# EAGLE design FeatherAdapter (EAGLE 9.6.2)
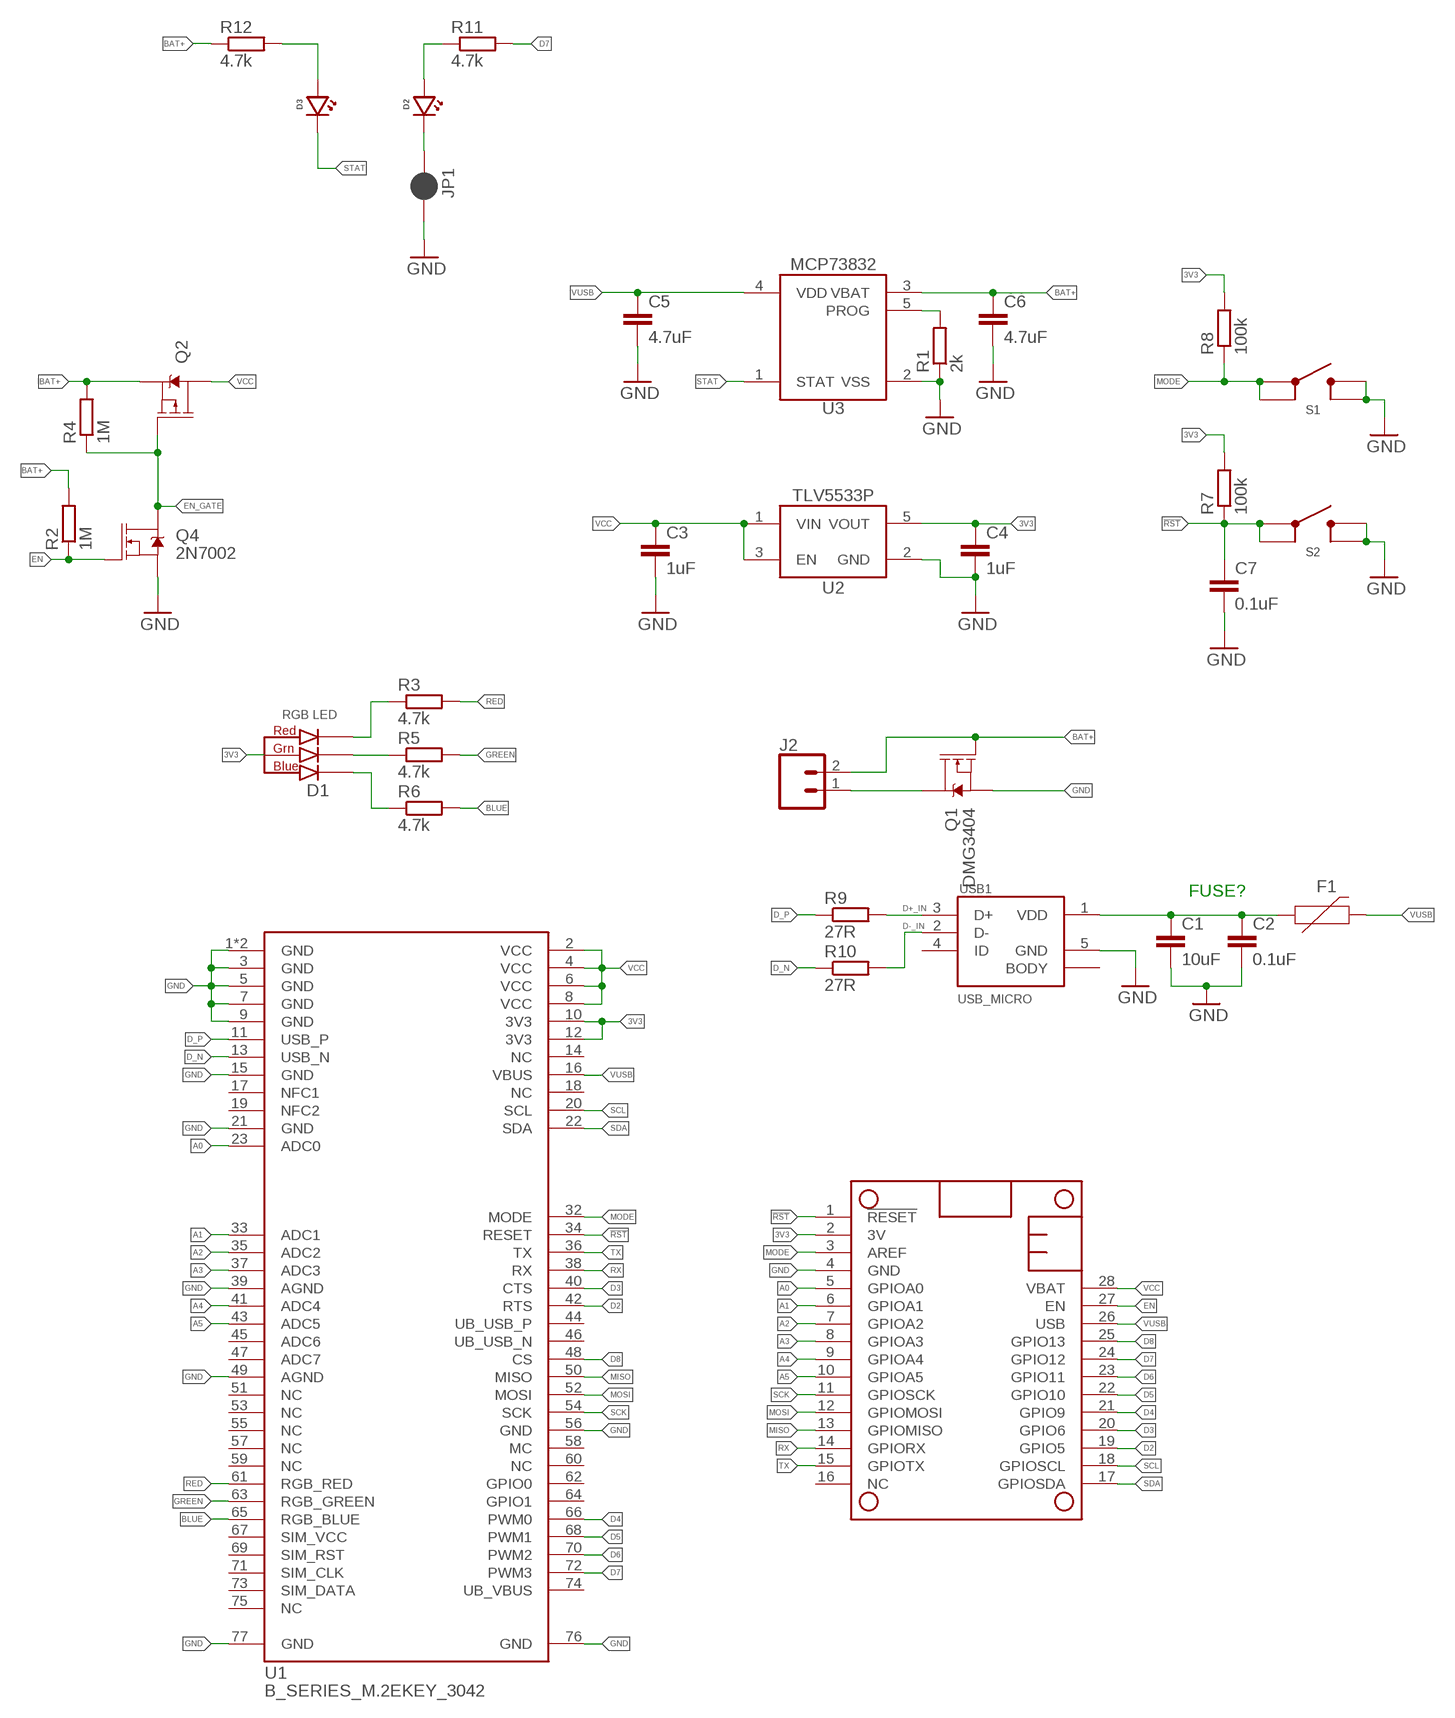
[diagram p0: schematic, sheet 1]

## Parts
C1  10uF  C-EU10UFC0805  [C0805]
C2  0.1uF  C-EU0.1UFC0402  [C0402]
C3  1uF  C-EU1UFC0603  [C0603]
C4  1uF  C-EU1UFC0603  [C0603]
C5  4.7uF  C-EU4.7UFC0805  [C0805]
C6  4.7uF  C-EU4.7UFC0805  [C0805]
C7  0.1uF  C-EU0.1UFC0402  [C0402]
D1  CLVBA-FKA  [CLVBA-FKA]
D2  LEDBLUE0603  [LED_0603]
D3  LEDAMBER0603  [LED_0603]
F1  PPTC1.5A  [1206]
J2  CONN_02-JST-2MM-SMT  [JST-2-SMD]
JP1  JUMPER-SMT_2_NC_PASTE_SILK_ROUND  [SMT-JUMPER_2_NC_SILK_ROUND]
MS1  FEATHERWING_SMD_LAYOUT  [FEATHER_SMD_MIN]
Q1  DMG3404  MOSFET-NCH-DMG3404L  [SOT23-3]
Q2  NX2301P  MOSFET-PCH-NX2301P  [SOT23-3]
Q4  2N7002  MOSFET-NCH-2N7002P  [SOT23-3]
R1  2k  R-EU_2KR0402  [R0402]
R2  1M  R-EU_1MR0402  [R0402]
R3  4.7k  R-EU_4.7KR0402  [R0402]
R4  1M  R-EU_1MR0402  [R0402]
R5  4.7k  R-EU_4.7KR0402  [R0402]
R6  4.7k  R-EU_4.7KR0402  [R0402]
R7  100k  R-EU_100KR0402  [R0402]
R8  100k  R-EU_100KR0402  [R0402]
R9  27R  R-EU_27R0402  [R0402]
R10  27R  R-EU_27R0402  [R0402]
R11  4.7k  R-EU_4.7KR0402  [R0402]
R12  4.7k  R-EU_4.7KR0402  [R0402]
S1  BUTTON4.5X4.5  [SWITCH_4.5MM]
S2  BUTTON4.5X4.5  [SWITCH_4.5MM]
U1  B_SERIES_M.2EKEY_3042  [PARTICLE_M.2EKEY]
U2  TLV755P3V3SOT23  [DBV0005A]
U3  MCP73832SOT  [SOT23-5]
USB1  USB_MICRO  [10118194-0001LF_10118194-0001LF_LONGER_PADS]

## Nets
3V3: C4.1 D1.2(ANODE) MS1.2(3V) R7.2 R8.2 U1.10(3V3) U1.12(3V3) U2.5(VOUT)
!RST: C7.1 MS1.1(!RESET) R7.1 S2.1 S2.2 U1.34(RESET)
A0: MS1.5(GPIOA0) U1.23(ADC0)
A1: MS1.6(GPIOA1) U1.33(ADC1)
A2: MS1.7(GPIOA2) U1.35(ADC2)
A3: MS1.8(GPIOA3) U1.37(ADC3)
A4: MS1.9(GPIOA4) U1.41(ADC4)
A5: MS1.10(GPIOA5) U1.43(ADC5)
BAT+: C6.1 J2.2 Q1.1(G) Q2.2(S) R2.2 R4.2 R12.1 U3.3(VBAT)
BAT-: J2.1 Q1.3(D)
BLUE: R6.2 U1.65(RGB_BLUE)
D2: MS1.19(GPIO5) U1.42(RTS)
D3: MS1.20(GPIO6) U1.40(CTS)
D4: MS1.21(GPIO9) U1.66(PWM0)
D5: MS1.22(GPIO10) U1.68(PWM1)
D6: MS1.23(GPIO11) U1.70(PWM2)
D7: MS1.24(GPIO12) R11.2 U1.72(PWM3)
D8: MS1.25(GPIO13) U1.48(CS)
D+_IN: R9.2 USB1.3(D+)
D-_IN: R10.2 USB1.2(D-)
D_N [diff pairs]: R10.1 U1.13(USB_N)
D_P [diff pairs]: R9.1 U1.11(USB_P)
EN: MS1.27(EN) Q4.1(G) R2.1
EN_GATE: Q2.1(G) Q4.3(D) R4.1
GND: C1.2 C2.2 C3.2 C4.2 C5.2 C6.2 C7.2 JP1.2 MS1.4(GND) Q1.2(S) Q4.2(S) R1.1 S1.3 S1.4 S2.3 S2.4 U1.1(GND) U1.3(GND) U1.5(GND) U1.7(GND) U1.9(GND) U1.15(GND) U1.21(GND) U1.39(AGND) U1.49(AGND) U1.56(GND) U1.76(GND) U1.77(GND) U1.GND U2.2(GND) U3.2(VSS) USB1.5(GND)
GREEN: R5.2 U1.63(RGB_GREEN)
MISO: MS1.13(GPIOMISO) U1.50(MISO)
MODE: MS1.3(AREF) R8.1 S1.1 S1.2 U1.32(MODE)
MOSI: MS1.12(GPIOMOSI) U1.52(MOSI)
N$2: R1.2 U3.5(PROG)
N$3: C1.1 C2.1 F1.1 USB1.1(VDD)
N$4: D2.CATHODE JP1.1
N$5: D1.1(RED_CATH) R3.1
N$6: D1.4(GREEN_CATH) R5.1
N$7: D1.3(BLUE_CATH) R6.1
N$8: D2.ANODE R11.1
N$10: D3.ANODE R12.2
RED: R3.2 U1.61(RGB_RED)
RX: MS1.14(GPIORX) U1.38(RX)
SCK: MS1.11(GPIOSCK) U1.54(SCK)
SCL: MS1.18(GPIOSCL) U1.20(SCL)
SDA: MS1.17(GPIOSDA) U1.22(SDA)
STAT: D3.CATHODE U3.1(STAT)
TX: MS1.15(GPIOTX) U1.36(TX)
VCC: C3.1 MS1.28(VBAT) Q2.3(D) U1.2(VCC) U1.4(VCC) U1.6(VCC) U1.8(VCC) U2.1(VIN) U2.3(EN)
VUSB: C5.1 F1.2 MS1.26(USB) U1.16(VBUS) U3.4(VDD)
Unconnected: MS1.16(NC) U1.14(NC) U1.17(NFC1) U1.18(NC) U1.19(NFC2) U1.44(UB_USB_P) U1.45(ADC6) U1.46(UB_USB_N) U1.47(ADC7) U1.51(NC) U1.53(NC) U1.55(NC) U1.57(NC) U1.58(MC) U1.59(NC) U1.60(NC) U1.62(GPIO0) U1.64(GPIO1) U1.69(SIM_RST) U1.71(SIM_CLK) U1.73(SIM_DATA) U1.75(NC) U1.!RESET U1.SWCLK U1.SWDIO U1.SWO USB1.4(ID) USB1.BODY@1(BODY) USB1.BODY@2(BODY) USB1.BODY@3(BODY) USB1.BODY@4(BODY) USB1.BODY@7(BODY) USB1.BODY@8(BODY)

## Notes on the sheet
- FUSE?

## Power pins joined to a net without a drawn wire
SIM_VCC: U1.67(SIM_VCC)
UB_VBUS: U1.74(UB_VBUS)

## Library data of the parts
C1 = bschulz_passives:C-EU: CAPACITOR, European symbol; DIGIKEY: 490-6473-1-ND; MF: Murata; MPN: GRM21BR61C106KE15K
C2 C7 = bschulz_passives:C-EU: CAPACITOR, European symbol; DIGIKEY: 490-4759-1-ND; MF: Murata; MPN: GCM155R71C104KA55D
C3 C4 = bschulz_passives:C-EU: CAPACITOR, European symbol; DIGIKEY: 587-2984-1-ND; MF: Yaiyo Yuden; MPN: TMK107B7105KA-T
C5 C6 = bschulz_passives:C-EU: CAPACITOR, European symbol; DIGIKEY: 399-7415-1-ND; MF: Kemet; MPN: C0805C475K4RACTU
D1 = bschulz:CLVBA-FKA: Cree RGB LED, Small Package, Common Anode, CLVBA-FKA Digikey: https://www.digikey.com/product-detail/en/cree-inc/CLVBA-FKA-CAEDH8BBB7A363/CLVBA-FKA-CAEDH8BBB7A363CT-ND/2650500; DIGIKEY: CLVBA-FKA-CAEDH8BBB7A363CT-ND; MF: Cree; MPN: CLVBA-FKA-CAEDH8BBB7A363
D2 = bschulz:LED: Genaric LED; DIGIKEY: 732-4966-1-ND; MF: Wurth; MPN: 150060BS75000
D3 = bschulz:LED: Genaric LED; DIGIKEY: 732-150060AS75000CT-ND; MF: Wurth; MPN: 150060AS75000
F1 = bschulz:PPTC: Bel Fuse PPTC; DIGIKEY: MF-NSMF150-2CT-ND; MF: Bourns; MPN: MF-NSMF150-2
J2 = bschulz:CONN_02: Genaric 2 terminal header SCREW_2.54 <https://www.digikey.com/product-detail/en/on-shore-technology-inc/OSTVN02A150/ED10561-ND/1588862> 39532_RA <https://www.digikey.com/product-detail/en/molex/0395321002/WM7845-ND/1280696>; DIGIKEY: 455-1749-1-ND; MF: JST; MPN: S2B-PH-SM4-TB(LF)(SN); PROD_ID: CONN-11443
JP1 = bschulz:JUMPER-SMT_2_NC_PASTE: Normally closed solder jumper This jumper has an aperture in the stencil to allow solder paste to bridge the split in the wire so it's normally closed (NC). Wick off the solder to open the connection. Reapply solder to reclose the connection.; DIGIKEY: DNP; MF: N/A; MPN: N/A
MS1 = bschulz:FEATHERWING
Q1 = bschulz:MOSFET-NCH: N-channel MOSFET Small Signal/Low Power: BSS138 2N7002P 2N7002PW RE1C002UN; DIGIKEY: DMG3404L-7DICT-ND; MF: Diodes Incorporated; MPN: DMG3404L-7
Q2 = bschulz:MOSFET-PCH: P-channel MOSFET Small Signal/Low Power:; DIGIKEY: 1727-1148-1-ND; MF: Nexperia; MPN: NX2301P,215
Q4 = bschulz:MOSFET-NCH: N-channel MOSFET Small Signal/Low Power: BSS138 2N7002P 2N7002PW RE1C002UN; DIGIKEY: 1727-4692-1-ND; MF: Nexperia; MPN: 2N7002P,215
R1 = bschulz_passives:R-EU_: RESISTOR, European symbol Digikey Parts: Yageo, 0402 <https://www.digikey.com/products/en/resistors/chip-resistor-surface-mount/52?k=&pkeyword=&sv=0&s=4356&sf=1&FV=-1%7C13%2C7%7C2%2C1291%7C39157%2C1989%7C0%2C-8%7C52%2C3%7C1131%2C3%7C2503&quantity=&ColumnSort=0&page=1&stock=1&pageSize=25> Yageo, 0603 <https://www.digikey.com/products/en/resistors/chip-resistor-surface-mount/52?k=&pkeyword=&sv=0&pv1291=39245&sf=1&FV=-5%7C4356%2C-5%7C47360%2C-8%7C52%2C-1%7C13%2C7%7C2%2C1989%7C0&quantity=10&ColumnSort=1000011&page=1&stock=1&pageSize=25> Panasonic, 0603 <https://www.digikey.com/products/en/resistors/chip-resistor-surface-mount/52?k=&pkeyword=&pv252=68&sf=0&FV=ffec373d%2C1c0002%2C142c040c%2C1f140000%2Cffe00034%2C80002%2Cc0001&quantity=&ColumnSort=0&page=1&stock=1&pageSize=25> Panasonic, precision, 0603 <https://www.digikey.com/products/en/resistors/chip-resistor-surface-mount/52?FV=ffec4907%2Cfffc000a%2Cc0172%2C142c040c%2C1f140000%2Cffe00034%2C1c0002&quantity=100&ColumnSort=2085&page=1&stock=1&pageSize=25> Panasonic, 0805 <https://www.digikey.com/products/en/resistors/chip-resistor-surface-mount/52?k=&pkeyword=&pv3=1&sf=0&FV=ffec373d%2C1c0002%2C1f140000%2Cffe00034%2C142c040d&quantity=&ColumnSort=0&page=1&stock=1&pageSize=25> Rohm, current sense <https://www.digikey.com/products/en/resistors/chip-resistor-surface-mount/52?k=&pkeyword=&pv3=1&sf=0&FV=ffecb688%2C1f140000%2Cffe00034%2C1c0002&quantity=&ColumnSort=0&page=1&stock=1&pageSize=25> Vishay, pulse proof automotive <https://www.digikey.com/products/en/resistors/chip-resistor-surface-mount/52?k=&pkeyword=&pv7=2&sf=0&FV=ffec5d6b%2Cffe00034%2C1f140000&quantity=&ColumnSort=0&page=1&stock=1&pageSize=25>; DIGIKEY: 311-2KLRCT-ND; MF: Yageo; MPN: RC0402FR-072KL; VALUE_PART: 2k
R2 R4 = bschulz_passives:R-EU_: RESISTOR, European symbol Digikey Parts: Yageo, 0402 <https://www.digikey.com/products/en/resistors/chip-resistor-surface-mount/52?k=&pkeyword=&sv=0&s=4356&sf=1&FV=-1%7C13%2C7%7C2%2C1291%7C39157%2C1989%7C0%2C-8%7C52%2C3%7C1131%2C3%7C2503&quantity=&ColumnSort=0&page=1&stock=1&pageSize=25> Yageo, 0603 <https://www.digikey.com/products/en/resistors/chip-resistor-surface-mount/52?k=&pkeyword=&sv=0&pv1291=39245&sf=1&FV=-5%7C4356%2C-5%7C47360%2C-8%7C52%2C-1%7C13%2C7%7C2%2C1989%7C0&quantity=10&ColumnSort=1000011&page=1&stock=1&pageSize=25> Panasonic, 0603 <https://www.digikey.com/products/en/resistors/chip-resistor-surface-mount/52?k=&pkeyword=&pv252=68&sf=0&FV=ffec373d%2C1c0002%2C142c040c%2C1f140000%2Cffe00034%2C80002%2Cc0001&quantity=&ColumnSort=0&page=1&stock=1&pageSize=25> Panasonic, precision, 0603 <https://www.digikey.com/products/en/resistors/chip-resistor-surface-mount/52?FV=ffec4907%2Cfffc000a%2Cc0172%2C142c040c%2C1f140000%2Cffe00034%2C1c0002&quantity=100&ColumnSort=2085&page=1&stock=1&pageSize=25> Panasonic, 0805 <https://www.digikey.com/products/en/resistors/chip-resistor-surface-mount/52?k=&pkeyword=&pv3=1&sf=0&FV=ffec373d%2C1c0002%2C1f140000%2Cffe00034%2C142c040d&quantity=&ColumnSort=0&page=1&stock=1&pageSize=25> Rohm, current sense <https://www.digikey.com/products/en/resistors/chip-resistor-surface-mount/52?k=&pkeyword=&pv3=1&sf=0&FV=ffecb688%2C1f140000%2Cffe00034%2C1c0002&quantity=&ColumnSort=0&page=1&stock=1&pageSize=25> Vishay, pulse proof automotive <https://www.digikey.com/products/en/resistors/chip-resistor-surface-mount/52?k=&pkeyword=&pv7=2&sf=0&FV=ffec5d6b%2Cffe00034%2C1f140000&quantity=&ColumnSort=0&page=1&stock=1&pageSize=25>; DIGIKEY: 311-1.00MLRCT-ND; MF: Yageo; MPN: RC0402FR-071ML; VALUE_PART: 1M
R3 R5 R6 R11 R12 = bschulz_passives:R-EU_: RESISTOR, European symbol Digikey Parts: Yageo, 0402 <https://www.digikey.com/products/en/resistors/chip-resistor-surface-mount/52?k=&pkeyword=&sv=0&s=4356&sf=1&FV=-1%7C13%2C7%7C2%2C1291%7C39157%2C1989%7C0%2C-8%7C52%2C3%7C1131%2C3%7C2503&quantity=&ColumnSort=0&page=1&stock=1&pageSize=25> Yageo, 0603 <https://www.digikey.com/products/en/resistors/chip-resistor-surface-mount/52?k=&pkeyword=&sv=0&pv1291=39245&sf=1&FV=-5%7C4356%2C-5%7C47360%2C-8%7C52%2C-1%7C13%2C7%7C2%2C1989%7C0&quantity=10&ColumnSort=1000011&page=1&stock=1&pageSize=25> Panasonic, 0603 <https://www.digikey.com/products/en/resistors/chip-resistor-surface-mount/52?k=&pkeyword=&pv252=68&sf=0&FV=ffec373d%2C1c0002%2C142c040c%2C1f140000%2Cffe00034%2C80002%2Cc0001&quantity=&ColumnSort=0&page=1&stock=1&pageSize=25> Panasonic, precision, 0603 <https://www.digikey.com/products/en/resistors/chip-resistor-surface-mount/52?FV=ffec4907%2Cfffc000a%2Cc0172%2C142c040c%2C1f140000%2Cffe00034%2C1c0002&quantity=100&ColumnSort=2085&page=1&stock=1&pageSize=25> Panasonic, 0805 <https://www.digikey.com/products/en/resistors/chip-resistor-surface-mount/52?k=&pkeyword=&pv3=1&sf=0&FV=ffec373d%2C1c0002%2C1f140000%2Cffe00034%2C142c040d&quantity=&ColumnSort=0&page=1&stock=1&pageSize=25> Rohm, current sense <https://www.digikey.com/products/en/resistors/chip-resistor-surface-mount/52?k=&pkeyword=&pv3=1&sf=0&FV=ffecb688%2C1f140000%2Cffe00034%2C1c0002&quantity=&ColumnSort=0&page=1&stock=1&pageSize=25> Vishay, pulse proof automotive <https://www.digikey.com/products/en/resistors/chip-resistor-surface-mount/52?k=&pkeyword=&pv7=2&sf=0&FV=ffec5d6b%2Cffe00034%2C1f140000&quantity=&ColumnSort=0&page=1&stock=1&pageSize=25>; DIGIKEY: 311-4.7KJRCT-ND; MF: Yageo; MPN: RC0402JR-074K7L; VALUE_PART: 4.7k
R7 R8 = bschulz_passives:R-EU_: RESISTOR, European symbol Digikey Parts: Yageo, 0402 <https://www.digikey.com/products/en/resistors/chip-resistor-surface-mount/52?k=&pkeyword=&sv=0&s=4356&sf=1&FV=-1%7C13%2C7%7C2%2C1291%7C39157%2C1989%7C0%2C-8%7C52%2C3%7C1131%2C3%7C2503&quantity=&ColumnSort=0&page=1&stock=1&pageSize=25> Yageo, 0603 <https://www.digikey.com/products/en/resistors/chip-resistor-surface-mount/52?k=&pkeyword=&sv=0&pv1291=39245&sf=1&FV=-5%7C4356%2C-5%7C47360%2C-8%7C52%2C-1%7C13%2C7%7C2%2C1989%7C0&quantity=10&ColumnSort=1000011&page=1&stock=1&pageSize=25> Panasonic, 0603 <https://www.digikey.com/products/en/resistors/chip-resistor-surface-mount/52?k=&pkeyword=&pv252=68&sf=0&FV=ffec373d%2C1c0002%2C142c040c%2C1f140000%2Cffe00034%2C80002%2Cc0001&quantity=&ColumnSort=0&page=1&stock=1&pageSize=25> Panasonic, precision, 0603 <https://www.digikey.com/products/en/resistors/chip-resistor-surface-mount/52?FV=ffec4907%2Cfffc000a%2Cc0172%2C142c040c%2C1f140000%2Cffe00034%2C1c0002&quantity=100&ColumnSort=2085&page=1&stock=1&pageSize=25> Panasonic, 0805 <https://www.digikey.com/products/en/resistors/chip-resistor-surface-mount/52?k=&pkeyword=&pv3=1&sf=0&FV=ffec373d%2C1c0002%2C1f140000%2Cffe00034%2C142c040d&quantity=&ColumnSort=0&page=1&stock=1&pageSize=25> Rohm, current sense <https://www.digikey.com/products/en/resistors/chip-resistor-surface-mount/52?k=&pkeyword=&pv3=1&sf=0&FV=ffecb688%2C1f140000%2Cffe00034%2C1c0002&quantity=&ColumnSort=0&page=1&stock=1&pageSize=25> Vishay, pulse proof automotive <https://www.digikey.com/products/en/resistors/chip-resistor-surface-mount/52?k=&pkeyword=&pv7=2&sf=0&FV=ffec5d6b%2Cffe00034%2C1f140000&quantity=&ColumnSort=0&page=1&stock=1&pageSize=25>; DIGIKEY: 311-100KLRCT-ND; MF: Yageo; MPN: RC0402FR-07100KL; VALUE_PART: 100k
R9 R10 = bschulz_passives:R-EU_: RESISTOR, European symbol Digikey Parts: Yageo, 0402 <https://www.digikey.com/products/en/resistors/chip-resistor-surface-mount/52?k=&pkeyword=&sv=0&s=4356&sf=1&FV=-1%7C13%2C7%7C2%2C1291%7C39157%2C1989%7C0%2C-8%7C52%2C3%7C1131%2C3%7C2503&quantity=&ColumnSort=0&page=1&stock=1&pageSize=25> Yageo, 0603 <https://www.digikey.com/products/en/resistors/chip-resistor-surface-mount/52?k=&pkeyword=&sv=0&pv1291=39245&sf=1&FV=-5%7C4356%2C-5%7C47360%2C-8%7C52%2C-1%7C13%2C7%7C2%2C1989%7C0&quantity=10&ColumnSort=1000011&page=1&stock=1&pageSize=25> Panasonic, 0603 <https://www.digikey.com/products/en/resistors/chip-resistor-surface-mount/52?k=&pkeyword=&pv252=68&sf=0&FV=ffec373d%2C1c0002%2C142c040c%2C1f140000%2Cffe00034%2C80002%2Cc0001&quantity=&ColumnSort=0&page=1&stock=1&pageSize=25> Panasonic, precision, 0603 <https://www.digikey.com/products/en/resistors/chip-resistor-surface-mount/52?FV=ffec4907%2Cfffc000a%2Cc0172%2C142c040c%2C1f140000%2Cffe00034%2C1c0002&quantity=100&ColumnSort=2085&page=1&stock=1&pageSize=25> Panasonic, 0805 <https://www.digikey.com/products/en/resistors/chip-resistor-surface-mount/52?k=&pkeyword=&pv3=1&sf=0&FV=ffec373d%2C1c0002%2C1f140000%2Cffe00034%2C142c040d&quantity=&ColumnSort=0&page=1&stock=1&pageSize=25> Rohm, current sense <https://www.digikey.com/products/en/resistors/chip-resistor-surface-mount/52?k=&pkeyword=&pv3=1&sf=0&FV=ffecb688%2C1f140000%2Cffe00034%2C1c0002&quantity=&ColumnSort=0&page=1&stock=1&pageSize=25> Vishay, pulse proof automotive <https://www.digikey.com/products/en/resistors/chip-resistor-surface-mount/52?k=&pkeyword=&pv7=2&sf=0&FV=ffec5d6b%2Cffe00034%2C1f140000&quantity=&ColumnSort=0&page=1&stock=1&pageSize=25>; DIGIKEY: YAG3086CT-ND; MF: Yageo; MPN: RC0402FR-0727RL; VALUE_PART: 27
S1 S2 = bschulz:BUTTON: Genaric SPST Push button; DIGIKEY: PTS647SN50SMTR2LFSCT-ND; MF: C&K; MPN: PTS 647 SN50 SMTR2 LFS
U1 = Particle-Devices:B_SERIES_M.2EKEY_: Particle B Series SoM 3042 M.2 Connector with E Key Width = 30mm Length = 42mm Height = 4.2mm Key = E
U2 = bschulz:TLV755P: TLV755xx(x)P - Low IQ, Small Size, Low Dropout, Positive Voltage Regulator Characteristics: Vin: 1.45V ~ 5.5V Vout: Many, fixed IQ: 25μA (typ) Output Current: 500 mA Dropout Voltage: 238mV @ 500mA Operating Temperature: -40°C to 85°C Digikey: TLV75533PDBVR (3v3, SOT-23) <https://www.digikey.com/product-detail/en/texas-instruments/TLV75533PDBVR/296-50411-1-ND/9685550>; DIGIKEY: 296-50411-1-ND; DISP: TLV5533P; MF: TI; MPN: TLV75533PDBVR
U3 = bschulz:MCP7383*: MCP7383x - Single-Cell Integrated Li-Ion/LiPo Charge Controller With Status Output Characteristics: Vin: 3.75 ~ 6V IQ: 53μA typ Voltage Accuracy: 1% typ Output Current: 500 mA (max) Operating Temperature: -40°C to 85°C MCP73831: STAT output is tri-state logic MCP73832: STAT output is open drain Digikey: MCP73831T-2ACI/OTCT-ND (MCP73831, SOT) <https://www.digikey.com/product-detail/en/microchip-technology/MCP73831T-2ACI-OT/MCP73831T-2ACI-OTCT-ND/1979802> MCP73832T-2ACI/OTCT-ND (MCP73832, SOT) <https://www.digikey.com/product-detail/en/microchip-technology/MCP73832T-2ACI-OT/MCP73832T-2ACI-OTCT-ND/1979805>; DIGIKEY: MCP73832T-2ACI/OTCT-ND; DISP: MCP73832; MF: Microchip; MPN: MCP73832T-2ACI/OT
USB1 = bschulz:USB_MICRO: General Micro USB - AB Connector; DIGIKEY: 609-4618-1-ND; MF: Amphenol; MPN: 10118194-0001LF

## Board
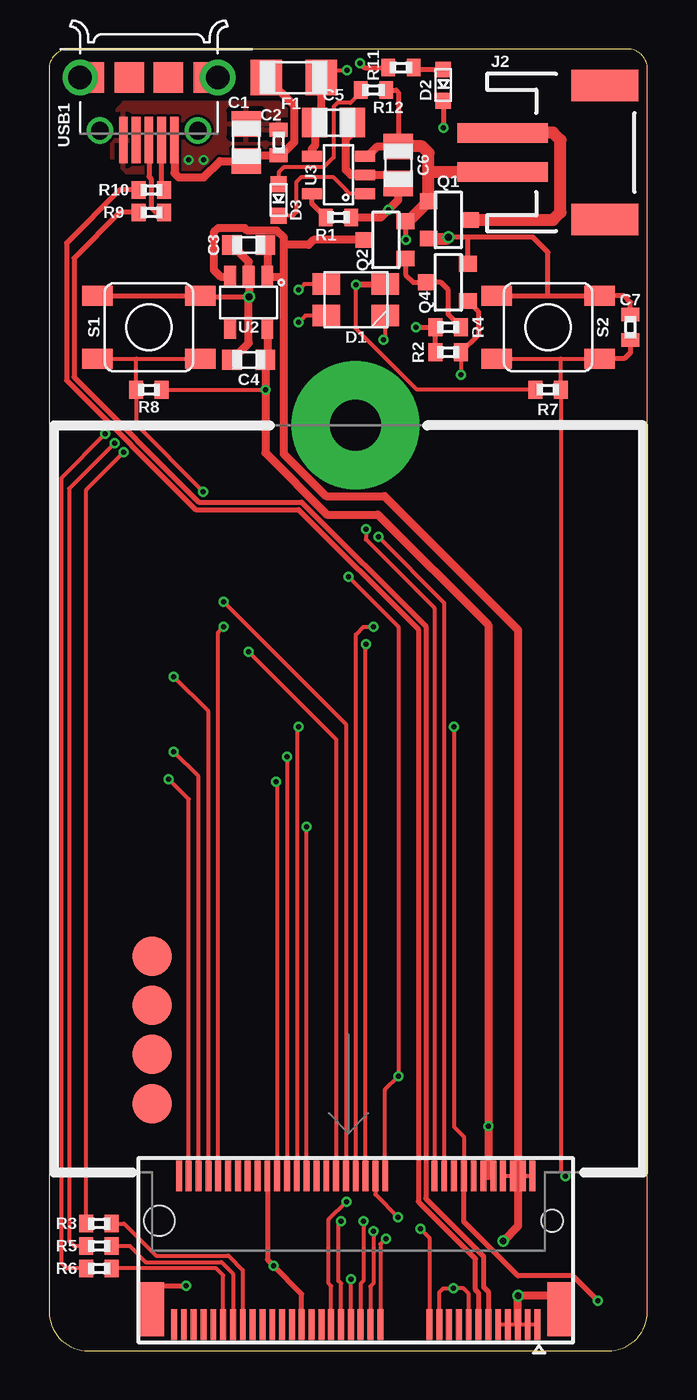
[diagram p1: board, top side]
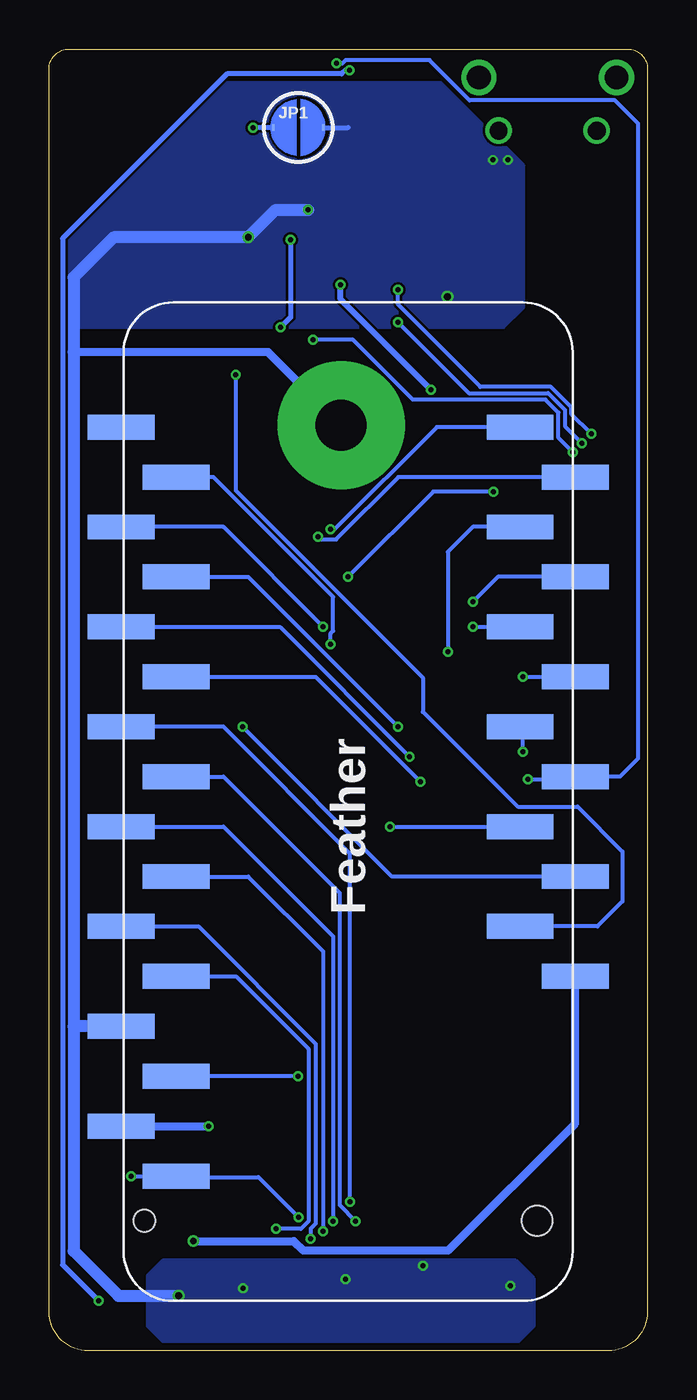
[diagram p2: board, bottom side, seen from below]

Size 30.46 x 66.22 mm. Coordinates in mm from the lower left corner, seen from the top.
Outline: 0,65.22 0,2 arc90 2,0 28.46,0 arc90 30.46,2 30.46,65.22 arc90 29.46,66.22 1,66.22 arc90 0,65.22
Copper layers (1*16): Top 0.035559375mm / dielectric 1.6mm / Bottom 0.035559375mm
Design rules "jlcpcb-2layer": minimum track width 5mil, minimum drill 0.2mm, track to track 5mil, track to pad 6mil, pad to pad 5mil, via to via 6mil, smd to smd 5mil, copper to edge 15mil, drill to drill 6mil, minimum pad ring 5mil, minimum via ring 5mil, stop-mask expansion 2.5mil, vias tented up to drill 0mil, thermal gap 10mil

### Footprints (pad centres in the part's own frame; a part is rotated, then mirrored left to right if it is on the bottom)
C0805 = smd 1.3 x 1.5: 1 -0.95,0; 2 0.95,0
C0402 = smd 0.7 x 0.9: 1 -0.65,0; 2 0.65,0
C0603 = smd 1 x 1: 1 -0.85,0; 2 0.85,0
CLVBA-FKA = smd 1.4 x 1.1: 1 -1.5,0.8; 2 -1.5,-0.8; 3 1.5,-0.8; 4 1.5,0.8
LED_0603 = smd 0.8 x 0.8: ANODE 0.8,0; CATHODE -0.8,0
1206 = smd 1.6 x 1.8: 1 -1.4,0; 2 1.4,0
JST-2-SMD = smd 1 x 4.6: 1 -1,-3.7; 2 1,-3.7 | smd 1.6 x 3.4: NC1 -3.4,1.5; NC2 3.4,1.5
SMT-JUMPER_2_NC_SILK_ROUND = smd 0.152 x 0.305: 1 -1.27,0; 2 1.27,0
FEATHER_SMD_MIN = smd 1.27 x 3.4 bottom: 1 -26.67,-8.76; 2 -24.13,-11.56; 3 -21.59,-8.76; 4 -19.05,-11.56; 5 -16.51,-8.76; 6 -13.97,-11.56; 7 -11.43,-8.76; 8 -8.89,-11.56; 9 -6.35,-8.76; 10 -3.81,-11.56; 11 -1.27,-8.76; 12 1.27,-11.56; 13 3.81,-8.76; 14 6.35,-11.56; 15 8.89,-8.76; 16 11.43,-11.56; 17 11.43,8.76; 18 8.89,11.56; 19 6.35,8.76; 20 3.81,11.56; 21 1.27,8.76; 22 -1.27,11.56; 23 -3.81,8.76; 24 -6.35,11.56; 25 -8.89,8.76; 26 -11.43,11.56; 27 -13.97,8.76; 28 -16.51,11.56
SOT23-3 = smd 0.8 x 0.9: 1 -0.95,-1; 2 0.95,-1; 3 0,1.1
R0402 = smd 0.7 x 0.9: 1 -0.65,0; 2 0.65,0
SWITCH_4.5MM = smd 1.55 x 1: 1 -2.625,1.6; 2 2.625,1.6; 3 -2.625,-1.6; 4 2.625,-1.6
PARTICLE_M.2EKEY = smd 0.3 x 1.55: 1 -9.62,3.735; 2 -9.37,-3.815; 3 -9.12,3.735; 4 -8.87,-3.815; 5 -8.62,3.735; 6 -8.37,-3.815; 7 -8.12,3.735; 8 -7.87,-3.815; 9 -7.62,3.735; 10 -7.37,-3.815; 11 -7.12,3.735; 12 -6.87,-3.815; 13 -6.62,3.735; 14 -6.37,-3.815; 15 -6.12,3.735; 16 -5.87,-3.815; 17 -5.62,3.735; 18 -5.37,-3.815; 19 -5.12,3.735; 20 -4.87,-3.815; 21 -4.62,3.735; 22 -4.37,-3.815; 23 -4.12,3.735; 32 -1.87,-3.815; 33 -1.62,3.735; 34 -1.37,-3.815; 35 -1.12,3.735; 36 -0.87,-3.815; 37 -0.62,3.735; 38 -0.37,-3.815; 39 -0.12,3.735; 40 0.13,-3.815; 41 0.38,3.735; 42 0.63,-3.815; 43 0.88,3.735; 44 1.13,-3.815; 45 1.38,3.735; 46 1.63,-3.815; 47 1.88,3.735; 48 2.13,-3.815; 49 2.38,3.735; 50 2.63,-3.815; 51 2.88,3.735; 52 3.13,-3.815; 53 3.38,3.735; 54 3.63,-3.815; 55 3.88,3.735; 56 4.13,-3.815; 57 4.38,3.735; 58 4.63,-3.815; 59 4.88,3.735; 60 5.13,-3.815; 61 5.38,3.735; 62 5.63,-3.815; 63 5.88,3.735; 64 6.13,-3.815; 65 6.38,3.735; 66 6.63,-3.815; 67 6.88,3.735; 68 7.13,-3.815; 69 7.38,3.735; 70 7.63,-3.815; 71 7.88,3.735; 72 8.13,-3.815; 73 8.38,3.735; 74 8.63,-3.815; 75 8.88,3.735 | smd 1.2 x 2.75: 76 9.98,2.96; 77 -10.72,2.96 | smd 2 x 2: !RESET 10,-7.5; SWCLK 10,-15; SWDIO 10,-12.5; SWO 10,-10 | drill 2.6 pad 6.5: GND -0.351,-42 | hole 1.1: -10.37,-1.54 | hole 1.55: 9.63,-1.54
DBV0005A = smd 1.1 x 0.6: 1 -1.3,0.95; 2 -1.3,0; 3 -1.3,-0.95; 4 1.3,-0.95; 5 1.3,0.95
SOT23-5 = smd 0.55 x 1: 1 -0.95,-1.35; 2 0,-1.35; 3 0.95,-1.35; 4 0.95,1.35; 5 -0.95,1.35
10118194-0001LF_10118194-0001LF_LONGER_PADS = smd 0.45 x 2.35: 1 -1.3,3.175; 2 -0.65,3.175; 3 0,3.175; 4 0.65,3.175; 5 1.3,3.175 | drill 0.9: BBODY@1 -2.5,2.7; BBODY@2 2.5,2.7 | drill 1.2: BODY@1 -3.5,0; BODY@4 3.5,0 | smd 1.5 x 1.55: BODY@2 -1,0; BODY@3 1,0; BODY@7 -3.032,0; BODY@8 3.032,0

### Placement (x,y rotation side)
C1  10.03,61.47 90 top
C2  11.68,61.47 90 top
C3  10.16,56.26 180 top
C4  10.16,50.42 180 top
C5  14.48,62.48 0 top
C6  17.78,60.33 270 top
C7  29.59,52.07 90 top
D1  15.62,53.47 180 top
D2  20.07,64.39 90 top
D3  11.68,58.55 90 top
F1  12.45,64.77 0 top
J2  26.8,60.96 270 top
JP1  17.78,62.23 0 bottom
MS1  15.24,35.56 90 top
Q1  20.32,57.53 270 top
Q2  17.14,56.52 90 top
Q4  20.32,54.36 90 top
R1  14.73,57.66 180 top
R2  20.32,50.8 180 top
R3  2.54,6.48 0 top
R4  20.32,52.07 180 top
R5  2.54,5.33 0 top
R6  2.54,4.19 0 top
R7  25.4,48.9 180 top
R8  5.08,48.9 0 top
R9  5.21,57.91 0 top
R10  5.21,59.05 0 top
R11  17.91,65.28 180 top
R12  16.51,64.14 180 top
S1  5.08,52.07 180 top
S2  25.4,52.07 180 top
U1  15.24,5.08 180 top
U2  10.16,53.34 270 top
U3  14.73,59.82 90 top
USB1  5.08,64.77 180 top

### Tracks (layer width: path | path; a pad name or v marks a point on that pad's centre or on a via)
3V3  (via drill 0.25)
  Top 0.2: U1.10 22.35,8.89 U1.12 | R8.2 v11.01,48.9 | R7.2 18.73,48.9 15.62,52 v15.62,54.23
  Top 0.305: v15.62,54.23 15.66,54.27 D1.2
  Top 0.406: U2.5 11.11,50.52 C4.1 v11.01,48.9 11.01,45.67 14.14,42.55 16.74,42.55 22.35,36.93 v22.35,11.43 22.35,8.89
  Bottom 0.305: v11.01,48.9 15.62,53.51 v15.62,54.23
  Bottom 0.406: MS1.2 v22.35,11.43
!RST  (via drill 0.25)
  Top 0.2: U1.34 16.61,7.96 v17.77,6.8 | S2.2 26.04,50.47 | 26.04,50.47 S2.1 | 26.04,50.47 26.05,50.45 R7.1 26.05,9.13 v26.29,8.89
  Top 0.254: C7.1 29.59,50.78 29.28,50.47 S2.1
  Bottom 0.2: v17.77,6.8 19.8,8.83 24,8.83 MS1.1 | MS1.1 | v26.29,8.89 MS1.1
A0  (via drill 0.25)
  Top 0.2: v18.91,6.21 19.36,5.76 U1.23
  Bottom 0.2: MS1.5 20.95,19.05 17.26,15.36 17.26,6.59 17.64,6.21 v18.91,6.21
A1  (via drill 0.25)
  Top 0.2: v17.14,5.71 16.86,5.43 U1.33
  Bottom 0.2: MS1.6 22.86,21.59 16.89,15.62 16.89,6.48 17.14,6.22 v17.14,5.71
A2  (via drill 0.25)
  Top 0.2: v16.51,6.1 16.51,3.43 16.36,3.28 U1.35
  Bottom 0.2: MS1.7 20.32,24.13 16.51,20.32 v16.51,6.1
A3  (via drill 0.25)
  Top 0.2: v16,6.6 16,3.56 15.86,3.41 U1.37
  Bottom 0.2: MS1.8 21.59,26.67 16,21.08 v16,6.6
A4  (via drill 0.25)
  Top 0.2: U1.41 14.86,3.42 14.86,3.43 14.73,3.56 14.73,6.48 v14.86,6.6
  Bottom 0.2: MS1.9 21.59,29.21 15.68,23.3 15.68,7.42 v14.86,6.6
A5  (via drill 0.25)
  Top 0.2: U1.43 14.36,3.29 14.22,3.43 14.22,6.68 v15.14,7.6
  Bottom 0.2: v15.14,7.6 15.14,25.3 21.59,31.75 MS1.10
BAT+  (via drill 0.25)
  Top 0.254: C6.1 17.78,64.02 17.67,64.14 R12.1 | Q2.2 18.14,56.53 v18.16,56.52 | v18.67,52.07 R4.2 R2.2
  Top 0.406: U3.3 16.21,60.77 16.72,61.27 C6.1
  Top 0.61: Q2.2 18.3,57.47 Q1.1 19.32,59.94 | 19.32,59.94 19.32,60.94 18.99,61.27 C6.1 | J2.2 19.34,59.96 19.32,59.94
  Bottom 0.254: v18.16,56.52 18.16,52.58 v18.67,52.07
BAT-
  Top 0.61: Q1.3 25.65,57.53 26.04,57.91 26.04,61.59 25.65,61.98 23.11,61.98 J2.1
BLUE
  Top 0.2: U1.65 8.86,3.84 8.51,4.19 R6.2
D2  (via drill 0.25)
  Top 0.2: v10.16,35.56 14.61,31.11 U1.42
  Bottom 0.2: MS1.19 8.89,41.91 10.16,40.64 v10.16,35.56
D3  (via drill 0.25)
  Top 0.2: v8.89,38.1 15.11,31.88 U1.40
  Bottom 0.2: MS1.20 7.62,39.37 v8.89,38.1
D4  (via drill 0.25)
  Top 0.2: U1.66 8.61,36.55 v8.89,36.83
  Bottom 0.2: v8.89,36.83 MS1.21
D5  (via drill 0.25)
  Top 0.2: U1.68 8.11,32.53 v6.35,34.29
  Bottom 0.2: v6.35,34.29 MS1.22
D6  (via drill 0.25)
  Top 0.2: U1.70 7.61,29.22 v6.35,30.48
  Bottom 0.2: v6.35,30.48 6.35,31.62 MS1.23
D7  (via drill 0.25)
  Top 0.2: U1.72 7.11,28.07 v6.1,29.08
  Top 0.254: v15.83,65.49 16.05,65.28 R11.2
  Bottom 0.2: v6.1,29.08 3.81,29.08 MS1.24 1.4,29.21 0.48,30.13 0.48,62.45 1.65,63.62 9.06,63.62 11.09,65.65 15.37,65.65 15.53,65.49 v15.83,65.49
D8  (via drill 0.25)
  Top 0.2: U1.48 v13.11,26.66 v13.12,26.67
  Bottom 0.2: v13.12,26.67 MS1.25
D+_IN
  Top 0.254: USB1.3 5.08,59.73 5.19,59.62 5.19,58.19 5.46,57.91 R9.2
D-_IN
  Top 0.254: R10.2 5.73,59.18 USB1.2
D_N
  Top 0.254: R10.1 3.6,59.05 0.89,56.34 0.89,49.37 7.46,42.8 12.7,42.8 18.8,36.7 18.8,7.59 21.7,4.68 21.7,3.1 21.86,2.95 U1.13
D_P
  Top 0.254: R9.1 3.6,57.91 1.27,55.58 1.27,49.53 7.62,43.18 12.86,43.18 19.18,36.86 19.18,7.75 22.11,4.81 22.11,3.26 22.36,3.01 U1.11
EN  (via drill 0.25)
  Top 0.2: R2.1 20.97,49.67 v20.95,49.66
  Top 0.254: Q4.1 21.84,52.88 21.84,51.67 R2.1
  Bottom 0.2: v20.95,49.66 20.95,43.77 11.43,34.24 11.43,32.51 6.61,27.68 3.56,27.68 1.27,25.4 1.27,22.86 2.54,21.59 MS1.27
EN_GATE
  Top 0.254: Q2.1 18.14,54.75 18.54,54.36 Q4.3 19.94,54.36 20.32,53.98 20.32,52.72 R4.1
GND  (via drill 0.25, 0.35)
  Top 0.2: U1.39 15.36,2.58 15.37,2.58 v15.37,3.63 | U1.9 U1.7 U1.5 U1.3 U1.1 | U1.21 19.86,2.97 20.07,3.17 v20.57,3.17 21.08,3.17 21.36,2.9 U1.15
  Top 0.254: S1.4 S1.3 7.84,53.67 7.89,53.62 v10.18,53.62 | S2.4 25.4,53.67 | 25.4,53.67 S2.3 29.28,53.67 29.59,53.35 C7.2 | 25.4,53.67 25.4,55.88 24.64,56.64 21.34,56.64 | 21.34,56.64 v20.32,56.64 | Q4.2 21.32,56.63 21.34,56.64 | U1.56 11.11,4.64 v11.43,4.32 12.86,2.89 U1.49 | U1.76 5.26,3.14 5.43,3.3 v6.99,3.3
  Top 0.406: R1.1 16.89,57.66 v17.27,58.04 17.78,58.55 C6.2 17.34,59.82 U3.2 15.37,59.82 15.11,60.07 15.11,61.66 15.43,61.98 C5.2 | C3.2 10.16,55.41 U2.2 10.18,54.62 v10.18,53.62 10.16,53.6 10.16,51.27 C4.2 | U1.77 25.96,2.37 25.54,2.79 v23.88,2.79 23.86,2.78 U1.5
  Top 0.61: Q1.2 20.26,56.58 v20.32,56.64
  Bottom 0.254: JP1.2 15.24,62.23
  Bottom 0.406: U1.GND 19.31,50.8 29.21,50.8
  Bottom 0.61: v17.27,58.04 18.92,58.04 v20.32,56.64 27.18,56.64 29.21,54.61 29.21,50.8 29.21,16.51 | 29.21,16.51 29.21,5.08 26.92,2.79 v23.88,2.79 | MS1.4 29.21,16.51
  other vias: 7.11,60.58 7.87,60.58
  pour Top: 3.17,62.87 3.17,60.71 3.94,59.94 11.3,59.94 12.32,60.96 12.32,63.12 11.94,63.5 3.81,63.5
  pour Bottom: 6.35,60.33 6.35,53.07 7.35,52.07 30.48,52.07 30.48,64.52 10.54,64.52
  cutout Bottom: 17.78,63.63 17.78,60.83 arc-90 16.38,62.23 arc-90
  pour Bottom: 24.64,4.57 6.73,4.57 5.84,3.68 5.84,1.27 7.11,0 24.13,0 25.4,1.27 25.4,3.81
GREEN
  Top 0.2: U1.63 9.36,3.93 8.77,4.52 4.92,4.52 4.1,5.33 R5.2
MISO  (via drill 0.25)
  Top 0.2: v12.7,31.75 12.61,31.66 U1.50
  Bottom 0.2: MS1.13 20.32,39.37 v12.7,31.75
MODE  (via drill 0.25)
  Top 0.2: U1.32 17.11,13.3 v17.78,13.97 17.78,36.83 v15.24,39.37 | S1.2 4.45,50.47 | 4.45,50.47 S1.1 | 4.45,50.47 4.43,50.45 R8.1 4.43,47.12 v7.84,43.71
  Bottom 0.2: v17.78,13.97 MS1.3 | v7.84,43.71 10.9,43.71 v15.24,39.37
MOSI  (via drill 0.25)
  Top 0.2: v12.1,30.23 U1.52
  Bottom 0.2: MS1.12 18.71,36.83 v12.1,30.23
N$2
  Top 0.254: R1.2 13.38,58.36 U3.5
N$3
  Top 0.406: USB1.1 6.38,59.91 6.6,59.69 7.87,59.69 8.7,60.52 C1.1 10.33,60.82 C2.1 11.81,60.82 12.49,61.5 12.49,63.33 F1.1
N$4  (via drill 0.25)
  Top 0.254: D2.CATHODE v20.07,62.23
  Bottom 0.254: JP1.1 v20.07,62.23
N$5  (via drill 0.25)
  Top 0.2: R3.1 1.89,43.8 v3.8,45.71 | v17.02,51.44 17.12,51.54 D1.1
  Bottom 0.2: v3.8,45.71 4.53,46.44 4.53,47.73 5.19,48.39 11.95,48.39 14.99,51.44 v17.02,51.44
N$6  (via drill 0.25)
  Top 0.2: D1.4 13.04,52.67 v12.7,52.32 | v3.33,46.17 1.02,43.86 1.02,5.59 1.27,5.33 R5.1
  Bottom 0.2: v12.7,52.32 9.09,48.72 5.05,48.72 4.2,47.87 4.2,47.05 v3.33,46.17
N$7  (via drill 0.25)
  Top 0.2: D1.3 12.99,54.27 v12.7,53.98 | R6.1 0.89,4.19 0.64,4.45 0.64,44.41 v2.86,46.64
  Bottom 0.2: v2.86,46.64 3.87,47.65 3.87,48 4.92,49.04 8.51,49.04 12.7,53.23 v12.7,53.98
N$8
  Top 0.254: R11.1 18.65,65.19 D2.ANODE
N$10
  Top 0.2: D3.ANODE 11.68,59.94 11.94,60.2 13.97,60.2 14.48,60.71 14.48,63.29 14.67,63.49 15.34,63.49 15.86,64.01 R12.2
RED
  Top 0.2: R3.2 3.81,6.48 5.44,4.84 9.12,4.84 9.86,4.11 U1.61
RX  (via drill 0.25)
  Top 0.2: U1.38 15.61,36.44 16,36.83 v16.51,36.83
  Bottom 0.2: v16.51,36.83 21.59,41.91 MS1.14
SCK  (via drill 0.25)
  Top 0.2: v11.56,28.96 11.61,28.9 U1.54
  Bottom 0.2: MS1.11 16.89,34.29 v11.56,28.96
SCL  (via drill 0.25)
  Top 0.2: v16.76,41.4 20.11,38.06 U1.20
  Bottom 0.2: MS1.18 12.68,44.45 15.85,41.28 16.64,41.28 v16.76,41.4
SDA  (via drill 0.25)
  Top 0.2: v16.13,41.78 16.13,41.27 19.61,37.79 U1.22
  Bottom 0.2: v16.13,41.78 15.94,41.78 10.73,46.99 MS1.17
STAT
  Top 0.2: U3.1 15.3,58.87 15.11,59.05 14.48,59.69 12.83,59.69 12.57,59.44 12.57,57.91 12.41,57.75 D3.CATHODE
TX  (via drill 0.25)
  Top 0.2: U1.36 16.11,35.92 v16.13,35.94
  Bottom 0.2: v16.13,35.94 16.13,36.49 16,36.62 16,38.36 22.1,44.45 MS1.15
VCC  (via drill 0.35)
  Top 0.2: U1.8 U1.6 23.88,8.89 U1.4 U1.2
  Top 0.406: C3.1 11.11,56.16 U2.1 11.91,54.64 11.94,54.61 | 23.88,8.89 23.88,36.68 17.08,43.47 14.1,43.47 11.94,45.63 11.94,54.61 | 11.94,56.26 11.94,56.64 11.59,56.99 10.08,56.99 9.96,57.12 8.6,57.12 8.38,56.9 8.38,54.99 8.73,54.64 U2.3 | 11.94,56.26 11.94,54.61 | U1.6 23.88,8.63 23.88,6.35 v23.11,5.59 | 11.94,56.26 13.21,56.26 13.46,56.52 Q2.3
  Bottom 0.406: v23.11,5.59 18.01,5.59 17.52,5.11 10.13,5.11 3.68,11.56 MS1.28
VUSB  (via drill 0.25)
  Top 0.2: v20.62,31.75 20.62,11.39 21.11,10.89 U1.16 | F1.2 14.22,65.15 v15.16,65.15
  Top 0.254: v27.94,2.54 26.67,3.81 23.88,3.81 21.11,6.58 U1.16
  Top 0.406: F1.2 13.85,62.8 C5.1 13.53,61.29 13.38,61.15 U3.4
  Bottom 0.2: MS1.26 13,24.13 v20.62,31.75
  Bottom 0.254: v15.16,65.15 15.37,65.15 15.56,64.96 21.4,64.96 29.77,56.59 29.77,4.37 v27.94,2.54

### Text on the board
tDocu: D7 | - | + | CHG | MODE | RESET | Breakout-Particle-SoM / FeatherAdapter / v0.0 / Bobby Schulz | J3
bDocu: J1 | J2